# EAGLE design source_wifi (EAGLE 7.6.0)
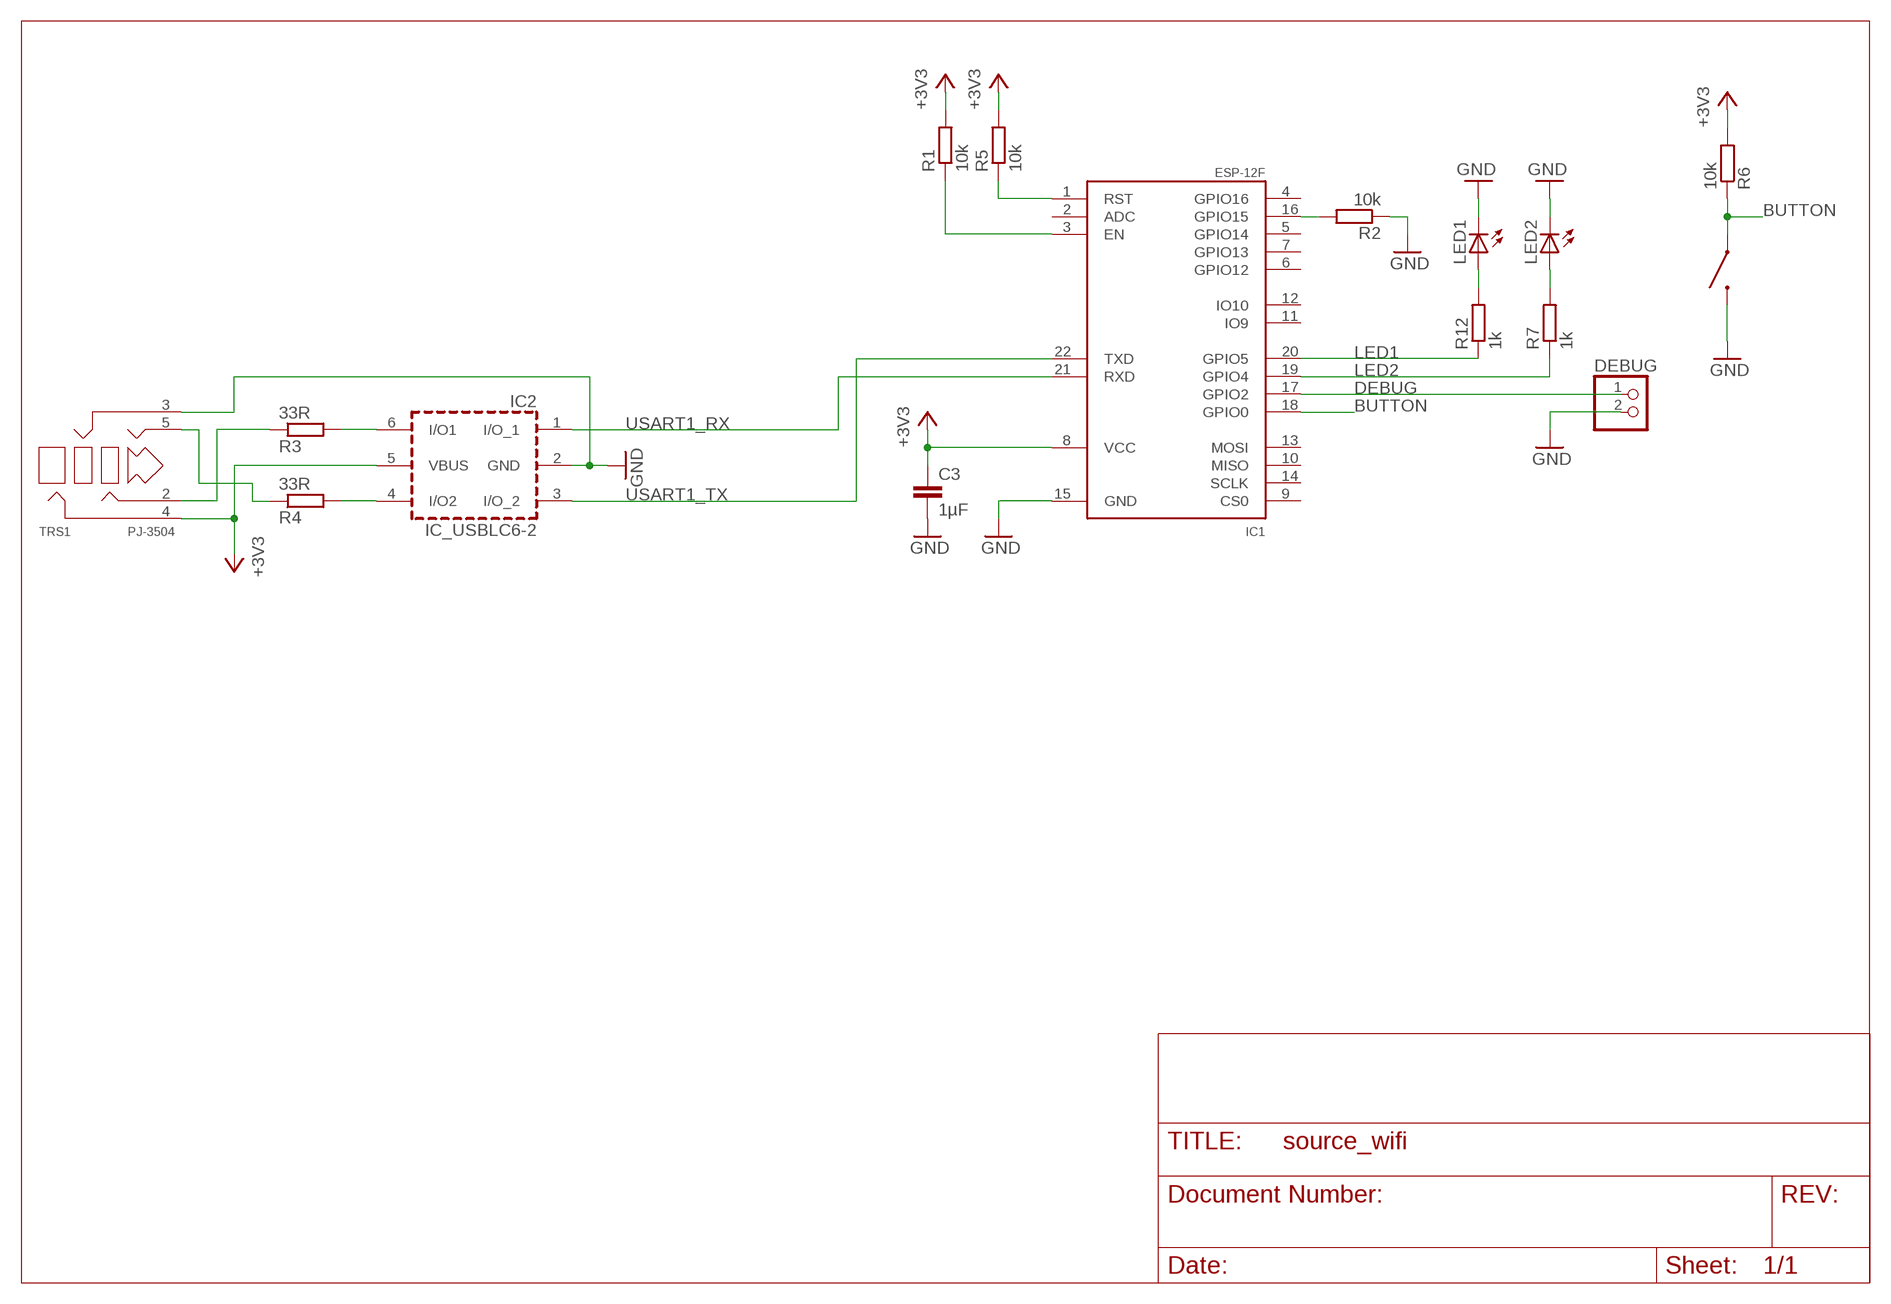
[diagram p0: schematic, sheet 1]

## Parts
C3  1µF  C-EUC0603  [C0603]
DEBUG  HEADER-1X2ROUND  [1X02_ROUND]
IC1  ESP-12F  [ESP-12F]
IC2  IC_USBLC6-2  [SOT-23-6L]
ISP  TACT-SWITCH-40-40  [40-40]
LED1  LEDCHIP-LED0603  [CHIP-LED0603]
LED2  LEDCHIP-LED0603  [CHIP-LED0603]
R1  10k  R-EU_R0603  [R0603]
R2  10k  R-EU_R0603  [R0603]
R3  33R  R-EU_R0603  [R0603]
R4  33R  R-EU_R0603  [R0603]
R5  10k  R-EU_R0603  [R0603]
R6  10k  R-EU_R0603  [R0603]
R7  1k  R-EU_R0603  [R0603]
R12  1k  R-EU_R0603  [R0603]
TRS1  PJ-3504  [YD-PJ-3504]

## Nets
+3V3: C3.1 IC1.8(VCC) IC2.5(VBUS) R1.2 R5.2 R6.2 TRS1.4
BUTTON: IC1.18(GPIO0) ISP.3 ISP.4 R6.1
DEBUG: DEBUG.1 IC1.17(GPIO2)
GND: C3.2 DEBUG.2 IC1.15(GND) IC2.2(GND) ISP.1 ISP.2 LED1.C LED2.C R2.1 TRS1.3
LED1: IC1.20(GPIO5) R12.1
LED2: IC1.19(GPIO4) R7.1
N$1: IC1.3(EN) R1.1
N$2: IC1.16(GPIO15) R2.2
N$3: IC1.1(RST) R5.1
N$4: R3.1 TRS1.2
N$5: LED2.A R7.2
N$6: LED1.A R12.2
N$7: IC2.6(I/O1) R3.2
N$8: R4.1 TRS1.5
N$25: IC2.4(I/O2) R4.2
USART1_RX: IC1.21(RXD) IC2.1(I/O_1)
USART1_TX: IC1.22(TXD) IC2.3(I/O_2)
Unconnected: IC1.2(ADC) IC1.4(GPIO16) IC1.5(GPIO14) IC1.6(GPIO12) IC1.7(GPIO13) IC1.9(CS0) IC1.10(MISO) IC1.11(IO9) IC1.12(IO10) IC1.13(MOSI) IC1.14(SCLK)

## Library data of the parts
C3 = rcl:C-EU: CAPACITOR, European symbol
DEBUG = microbuilder:HEADER-1X2: PIN HEADER
IC1 = espressif:ESP-12F
IC2 = dp_devices:IC_USBLC6-2
ISP = tactile-switch:TACT-SWITCH-40-40
LED1 LED2 = led:LED: LED OSRAM: - CHIPLED LG R971, LG N971, LY N971, LG Q971, LY Q971, LO R971, LY R971 LH N974, LH R974 LS Q976, LO Q976, LY Q976 LO Q996 - Hyper CHIPLED LW Q18S LB Q993, LB Q99A, LB R99A - SideLED LS A670, LO A670, LY A670, LG A670, LP A670 LB A673, LV A673, LT A673, LW A673 LH A674 LY A675 LS A676, LA A676, LO A676, LY A676, LW A676 LS A679, LY A679, LG A679 - Hyper Micro SIDELED® LS Y876, LA Y876, LO Y876, LY Y876 LT Y87S - SmartLED LW L88C, LW L88S LB L89C, LB L89S, LG L890 LS L89K, LO L89K, LY L89K LS L896, LA L896, LO L896, LY L896 - TOPLED LS T670, LO T670, LY T670, LG T670, LP T670 LSG T670, LSP T670, LSY T670, LOP T670, LYG T670 LG T671, LOG T671, LSG T671 LB T673, LV T673, LT T673, LW T673 LH T674 LS T676, LA T676, LO T676, LY T676, LB T676, LH T676, LSB T676, LW T676 LB T67C, LV T67C, LT T67C, LS T67K, LO T67K, LY T67K, LW E67C LS E67B, LA E67B, LO E67B, LY E67B, LB E67C, LV E67C, LT E67C LW T67C LS T679, LY T679, LG T679 LS T770, LO T770, LY T770, LG T770, LP T770 LB T773, LV T773, LT T773, LW T773 LH T774 LS E675, LA E675, LY E675, LS T675 LS T776, LA T776, LO T776, LY T776, LB T776 LHGB T686 LT T68C, LB T68C - Hyper Mini TOPLED® LB M676 - Mini TOPLED Santana® LG M470 LS M47K, LO M47K, LY M47K Source: http://www.osram.convergy.de LUXEON: - LUMILED® LXK2-PW12-R00, LXK2-PW12-S00, LXK2-PW14-U00, LXK2-PW14-V00 LXK2-PM12-R00, LXK2-PM12-S00, LXK2-PM14-U00 LXK2-PE12-Q00, LXK2-PE12-R00, LXK2-PE12-S00, LXK2-PE14-T00, LXK2-PE14-U00 LXK2-PB12-K00, LXK2-PB12-L00, LXK2-PB12-M00, LXK2-PB14-N00, LXK2-PB14-P00, LXK2-PB14-Q00 LXK2-PR12-L00, LXK2-PR12-M00, LXK2-PR14-Q00, LXK2-PR14-R00 LXK2-PD12-Q00, LXK2-PD12-R00, LXK2-PD12-S00 LXK2-PH12-R00, LXK2-PH12-S00 LXK2-PL12-P00, LXK2-PL12-Q00, LXK2-PL12-R00 Source: www.luxeon.com KINGBRIGHT: KA-3528ASYC Source: www.kingbright.com
R1-R7 R12 = rcl:R-EU_: RESISTOR, European symbol
TRS1 = con-trs:PJ-3504

## Board
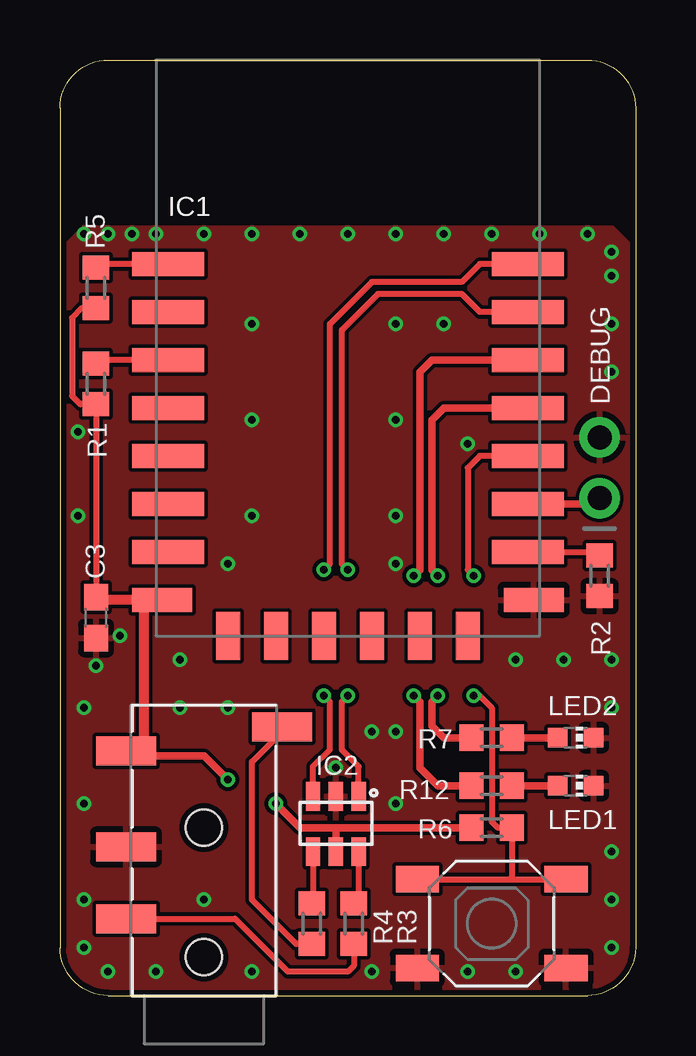
[diagram p1: board, top side]
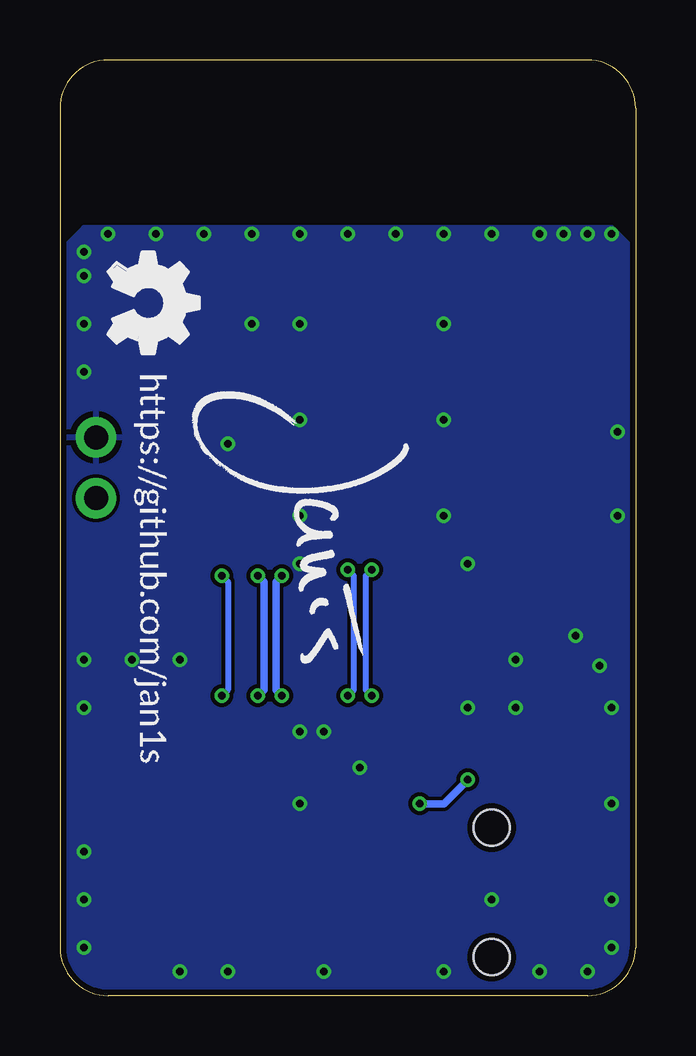
[diagram p2: board, bottom side, seen from below]

Size 24 x 39 mm. Coordinates in mm from the lower left corner, seen from the top.
Outline: 2,0 22,0 arc90 24,2 24,37 arc90 22,39 2,39 arc90 0,37 0,2 arc90 2,0
Copper layers (1*16): Top 0.035mm / dielectric 1.5mm / Bottom 0.035mm
Design rules "default": minimum track width 6mil, minimum drill 12mil, track to track 6mil, track to pad 6mil, pad to pad 6mil, via to via 6mil, smd to smd 0mil, copper to edge 10mil, drill to drill 10mil, minimum pad ring 10mil, minimum via ring 6mil, stop-mask expansion 2mil, vias tented up to drill 100mil, thermal gap 10mil

### Footprints (pad centres in the part's own frame; a part is rotated, then mirrored left to right if it is on the bottom)
C0603 = smd 1.1 x 1: 1 -0.85,0; 2 0.85,0
1X02_ROUND = drill 1 pad 1.676: 1 -1.27,0; 2 1.27,0
ESP-12F = smd 3 x 1: 1 -7.5,-8.5; 2 -7.5,-10.5; 3 -7.5,-12.5; 4 -7.5,-14.5; 5 -7.5,-16.5; 6 -7.5,-18.5; 7 -7.5,-20.5; 16 7.5,-20.5; 17 7.5,-18.5; 18 7.5,-16.5; 19 7.5,-14.5; 20 7.5,-12.5; 21 7.5,-10.5; 22 7.5,-8.5 | smd 2.5 x 1: 8 -7.75,-22.5; 15 7.75,-22.5 | smd 1 x 2: 9 -5,-24; 10 -3,-24; 11 -1,-24; 12 1,-24; 13 3,-24; 14 5,-24
SOT-23-6L = smd 0.6 x 1.2: 1 -0.95,-2.3; 2 0,-2.3; 3 0.95,-2.3; 4 0.95,0; 5 0,0; 6 -0.95,0
40-40 = smd 1.8 x 1.1: 1 -3.1,1.85; 2 3.1,1.85; 3 -3.1,-1.85; 4 3.1,-1.85
CHIP-LED0603 = smd 0.8 x 0.8: A 0,-0.75; C 0,0.75
R0603 = smd 1 x 1.1: 1 -0.85,0; 2 0.85,0
YD-PJ-3504 = smd 1.2 x 2.5: 2 3.2,3.25; 3 6.2,3.25; 4 10.2,3.25; 5 11.2,-3.25 | hole 1.5: 1.6,0; 7,0

### Placement (x,y rotation side)
C3  1.5,15.75 270 top
DEBUG  22.5,22 90 top
IC1  12,39 0 top
IC2  11.5,6 180 top
ISP  18,3 180 top
LED1  21.5,8.75 270 top
LED2  21.5,10.75 270 top
R1  1.5,25.5 270 top
R2  22.5,17.5 90 top
R3  12.25,3 90 top
R4  10.5,3 90 top
R5  1.5,29.5 270 top
R6  18,7 180 top
R7  18,10.75 0 top
R12  18,8.75 0 top
TRS1  6,0 90 top
U$1  [OSHW_FILLX150_NOTEXT]  22,31 270 bottom
U$2  [JANIS_10MM]  18.75,25.5 270 bottom
U$6  [GITHUB/JAN1S]  20.75,26 270 bottom

### Tracks (layer width: path | path; a pad name or v marks a point on that pad's centre or on a via)
+3V3  (via drill 0.32)
  Top 0.254: C3.1 R1.2 0.85,24.65 0.5,25 0.5,28.25 0.9,28.65 R5.2
  Top 0.305: IC2.5 11.5,7 | 11.5,7 R6.2 | 11.5,7 10,7 v9,8 | v7,9 6,10 3.75,10
  Top 0.406: 3.75,10 TRS1.4 3.2,10.2 3.5,10.5 3.5,16.5 | IC1.8 3.5,16.5 | 3.5,16.5 1.5,16.5 C3.1
  Bottom 0.305: v9,8 8,8 v7,9
BUTTON  (via drill 0.32)
  Top 0.254: IC1.18 17.5,22.5 17,22 17,17.75 v17.25,17.5 | v17.25,12.5 17.5,12.5 18,12 18,7.25 18.25,7 R6.1 18.85,4.95 18.75,4.85 | ISP.4 18.75,4.85 | 18.75,4.85 ISP.3
  Bottom 0.254: v17.25,17.5 17,17.25 17,12.75 v17.25,12.5
DEBUG
  Top 0.305: IC1.17 22.27,20.5 DEBUG.1
GND  (via drill 0.32)
  other vias: 6,4 4,1 1,4 1,2 2,1 11.5,9.5 13,1 23,2 23,4 23,6 23,12 23,14 1,8 1,12 14,8 13,11 14,11 17,1 19,1 23,26 23,28 23,30 23,31 2,31.75 1,31.75 3,31.75 4,31.75 6,31.75 8,31.75 10,31.75 12,31.75 14,31.75 16,31.75 18,31.75 20,31.75 22,31.75 16,28 14,28 14,24 1.5,13.75 2.5,15 21,14 19,14 7,12 5,12 5,14 7,18 8,1 14,18 8,28 8,24 8,20 14,20 17,23 0.75,23.5 0.75,20
  pour Top (rank 5): 1,32 23,32 24,31 24,1 23,0 1,0 0,1 0,31
  pour Bottom: 1,32 23,32 24,31 24,1 23,0 21.5,0 21.5,-1 16,-1 16,0 1,0 0,1 0,31
LED1  (via drill 0.32)
  Top 0.305: IC1.20 15.5,26.5 15,26 15,17.75 v14.75,17.5 | v14.75,12.5 15,12.25 15,9.5 15.75,8.75 R12.1
  Bottom 0.305: v14.75,17.5 15,17.25 15,12.75 v14.75,12.5
LED2  (via drill 0.32)
  Top 0.305: IC1.19 16,24.5 15.5,24 15.5,17.75 v15.75,17.5 | v15.75,12.5 15.5,12.25 15.5,11.25 16,10.75 R7.1
  Bottom 0.305: v15.75,17.5 15.5,17.25 15.5,12.75 v15.75,12.5
N$1
  Top 0.254: IC1.3 1.5,26.5 R1.1
N$2
  Top 0.254: IC1.16 22.5,18.5 R2.2
N$3
  Top 0.254: IC1.1 1.5,30.5 R5.1
N$4
  Top 0.254: TRS1.2 7.3,3.2 9.5,1 12,1 12.25,1.25 R3.1
N$5
  Top 0.305: LED2.A R7.2
N$6
  Top 0.305: LED1.A R12.2
N$7
  Top 0.254: IC2.6 12.45,4.05 R3.2
N$8
  Top 0.254: R4.1 9.85,2.15 8,4 8,9.75 9.25,11 TRS1.5
N$25
  Top 0.254: IC2.4 10.55,3.9 R4.2
USART1_RX  (via drill 0.32)
  Top 0.254: IC1.21 17.5,28.5 16.75,29.25 13.25,29.25 11.75,27.75 11.75,18 v12,17.75 | IC2.1 12.45,9.55 11.75,10.25 11.75,12.25 v12,12.5
  Bottom 0.254: v12,12.5 11.75,12.75 11.75,17.5 v12,17.75
USART1_TX  (via drill 0.32)
  Top 0.254: IC1.22 17.5,30.5 16.75,29.75 13,29.75 11.25,28 11.25,18 v11,17.75 | IC2.3 10.55,9.55 11.25,10.25 11.25,12.25 v11,12.5
  Bottom 0.254: v11,12.5 11.25,12.75 11.25,17.5 v11,17.75

### Text on the board
tNames: LED2 | LED1